# EasyEDA Pro project 交通信号灯第五版.epro

# Schematic 原理图
Create Date: 2024-08-05; Page Name: P1; Project Name: 交通信号灯转接板第五版; Schematic Name: 原理图; Update Date: 2024-08-15; Company: Chen; Page Size: A4; Version: V1.0
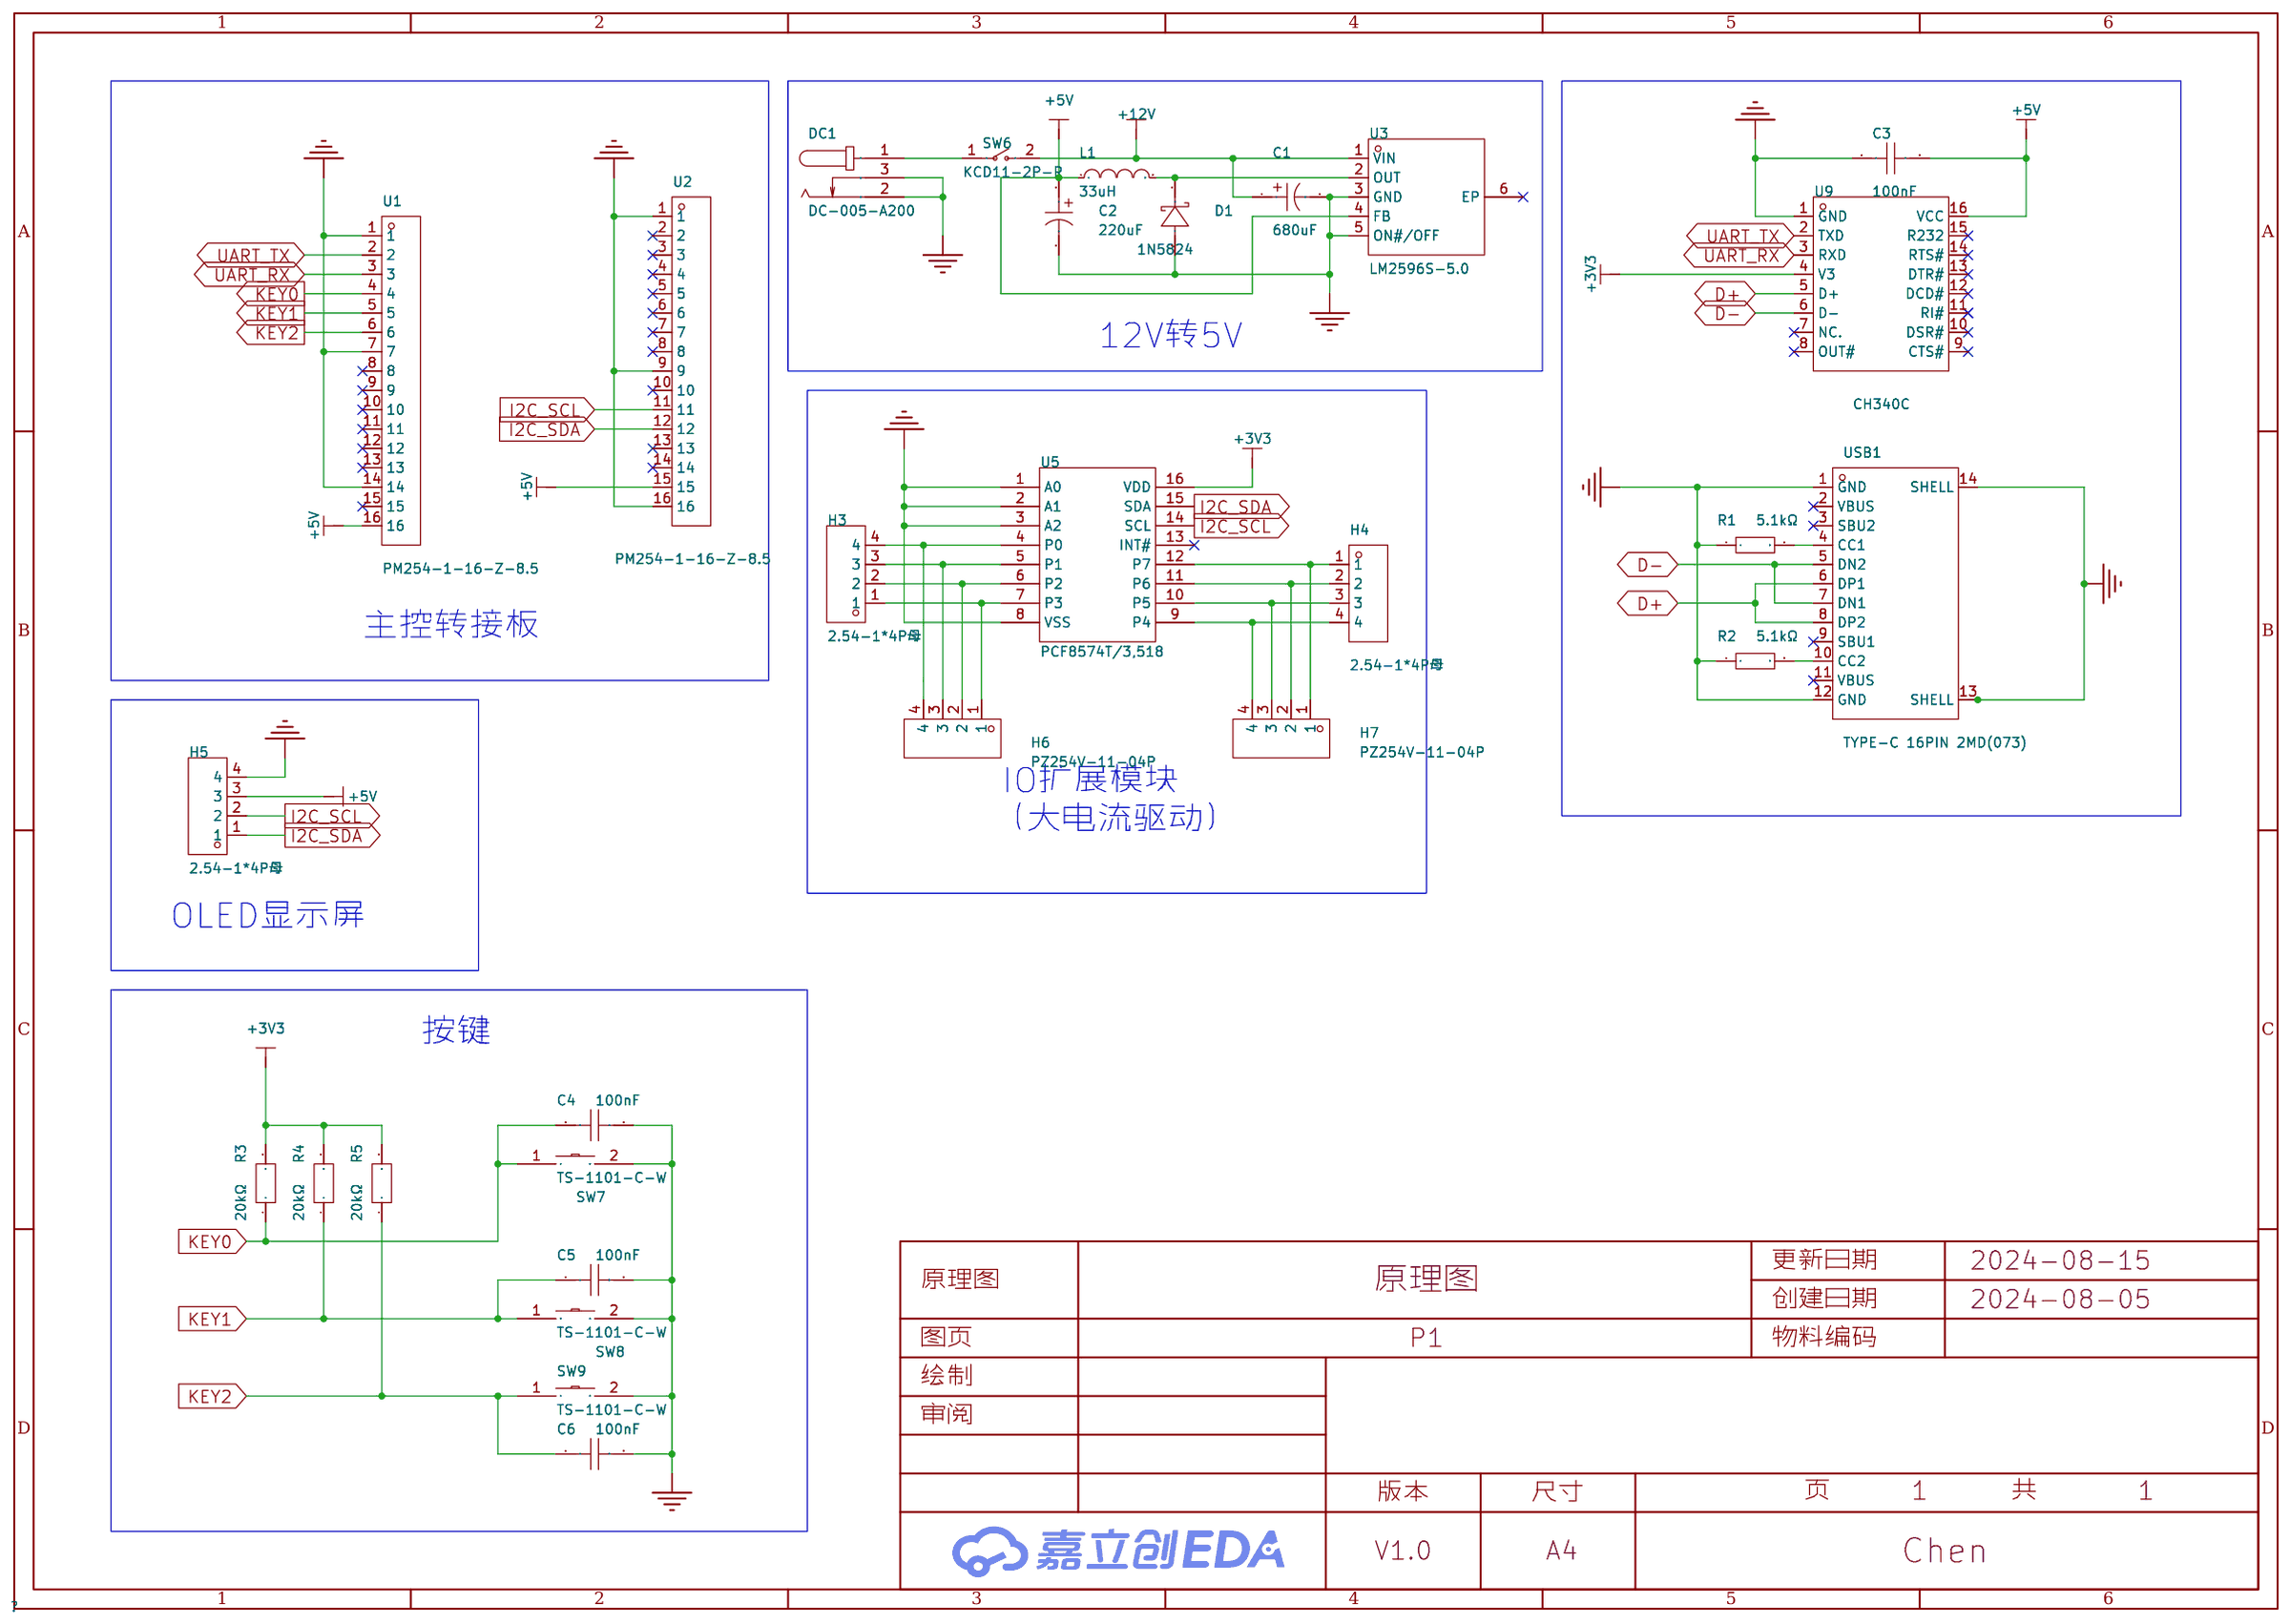
[diagram p0: schematic sheet]

## Parts
C1  680uF  [CAP-TH_BD8.0-P3.50-D0.6-FD]
C2  220uF  [CAP-SMD_BD6.3-L6.6-W6.6-LS7.4-FD]
C3  100nF  [CAP-TH_L7.2-W2.5-P5.00-D0.5]
C4  100nF  [CAP-TH_L7.2-W2.5-P5.00-D0.5]
C5  100nF  [CAP-TH_L7.2-W2.5-P5.00-D0.5]
C6  100nF  [CAP-TH_L7.2-W2.5-P5.00-D0.5]
D1  1N5824  [DO-27_BD5.3-L8.4-P12.40-D1.3-RD]
DC1  DC-005-A200  [DC-IN-TH_DC-005-A200]
H3  2.54-1*4P母  [HDR-TH_4P-P2.54-V-F]
H4  2.54-1*4P母  [HDR-TH_4P-P2.54-V-F]
H5  2.54-1*4P母  [HDR-TH_4P-P2.54-V-F]
H6  PZ254V-11-04P  [HDR-TH_4P-P2.54-V-M]
H7  PZ254V-11-04P  [HDR-TH_4P-P2.54-V-M]
L1  33uH  [IND-SMD_L7.0-W6.6_FXL0630]
R1  5.1kΩ  [R0603]
R2  5.1kΩ  [R0603]
R3  20kΩ  [R0603]
R4  20kΩ  [R0603]
R5  20kΩ  [R0603]
SW6  KCD11-2P-R  [SW-TH_2P-L15.0-W10.5-P5.00_KCD11-2P-R]
SW7  TS-1101-C-W  [SW-SMD_L6.0-W3.3-LS8.0]
SW8  TS-1101-C-W  [SW-SMD_L6.0-W3.3-LS8.0]
SW9  TS-1101-C-W  [SW-SMD_L6.0-W3.3-LS8.0]
U1  PM254-1-16-Z-8.5  [HDR-TH_16P-P2.54-V-F-A]
U2  PM254-1-16-Z-8.5  [HDR-TH_16P-P2.54-V-F-A]
U3  LM2596S-5.0  [TO-263-5_L10.2-W8.9-P1.70-BR]
U5  PCF8574T/3,518  [SOIC-16_L10.3-W7.5-P1.27-LS10.3-BL]
U9  CH340C  [SOP-16_L10.0-W3.9-P1.27-LS6.0-BL]
USB1  TYPE-C 16PIN 2MD(073)  [USB-C-SMD_TYPE-C-6PIN-2MD-073]

## Library data of the parts
C1 = SPT1AM681F12OR: 容值:680uF;精度:±20%;额定电压:10V;纹波电流:-;等效串联电阻:-;类型:-;; LCSC Part Name: 680uF ±20% 10V; Supplier Part: C698167; Manufacturer: Yunxing(云星); Supplier Footprint: 插件,D8xL12mm; JLCPCB Part Class: 扩展库; Datasheet: https://atta.szlcsc.com/upload/public/pdf/source/20200709/C697725_42901235359D2F905A7BBBDFFA1D5D23.pdf; Supplier: LCSC; Tolerance: ±20%; Rated Voltage: 10V; Lead Spacing: 3.5mm; φD: 8mm; L: 12mm; Lifetime @ Temp: 2000hrs@105℃; Operating Temperature: -55℃~+105℃
C2 = RVT1E221M0607: 容值:220uF;精度:±20%;额定电压:25V;纹波电流:150mA@120Hz;等效串联电阻:-;; LCSC Part Name: 220uF ±20% 25V; Supplier Part: C2918361; Manufacturer: ROQANG(容强); Supplier Footprint: SMD,D6.3xL7.7mm; JLCPCB Part Class: 扩展库; Datasheet: https://atta.szlcsc.com/upload/public/pdf/source/20211118/497C0614266278696CA52BDF245B991F.pdf; Supplier: LCSC; Tolerance: ±20%; Rated Voltage: 25V; Ripple Current: 150mA@120Hz; φD: 6.3mm; L: 7.7mm; Lifetime @ Temp: 2000hrs@105℃; Operating Temperature: -40℃~+105℃
C3-C6 = C242A104J2SC350: 容值:100nF;精度:±5%;额定电压:100V;介电材料:金属化聚酯膜电容;工作温度:-55℃~+125℃;; LCSC Part Name: 100nF ±5% 100V; Supplier Part: C401246; Manufacturer: faratronic(厦门法拉); Supplier Footprint: 插件,P=5mm; JLCPCB Part Class: 扩展库; Datasheet: https://atta.szlcsc.com/upload/public/pdf/source/20190717/C404864_C9CB3388AB32E0CC4E5DE29D1D44F6BC.pdf; Supplier: LCSC; Tolerance: ±5%; Voltage Rated: 100V; Dielectric Material: 金属化聚酯膜电容; Operating Temperature: -55℃~+125℃
D1 = 1N5824_C7503125: 二极管配置:独立式;正向压降(Vf):550mV@5A;直流反向耐压(Vr):30V;平均整流电流(Io):5A;; LCSC Part Name: 电压:30V 电流:5A; Supplier Part: C7503125; Manufacturer: FUXINSEMI(富芯森美); Supplier Footprint: DO-201AD; JLCPCB Part Class: 扩展库; Datasheet: https://atta.szlcsc.com/upload/public/pdf/source/20230904/20F3394C6D1B7A17743713246CA97DB3.pdf; Supplier: LCSC; Diode Configuration: 独立式; Forward Voltage (Vf@If): 550mV@5A; Reverse Voltage (Vr): 30V; Average Rectified Current (Io): 5A; Reverse Leakage Current (Ir): 500uA@30V; Peak forward surge current: 150A
DC1 = DC-005-A200: 连接器类型:DC电源插座;安装方式:弯插;触点内径:2mm;触点外径:6.4mm;额定电流:3A;额定电压:30V;工作温度范围:-20℃~+70℃;; LCSC Part Name: DC电源插座 内径:2mm 外径:6.4mm; Supplier Part: C720557; Manufacturer: XUNPU(讯普); Supplier Footprint: 插件; JLCPCB Part Class: 扩展库; Datasheet: https://atta.szlcsc.com/upload/public/pdf/source/20200812/C720557_2286DFCD6C75B71AF905731F627ABF3A.pdf; Supplier: LCSC; Connector Type: DC电源插座; Mounting Style: 弯插; Inside Contact Diameter: 2mm; Outside Contact Diameter: 6.4mm; Current Rating (Max): 3A; Voltage Rating (Max): 30V; Operating Temperature Range: -20℃~+70℃
H3-H5 = 2.54-1*4P母: 插孔结构:1x4P;间距:2.54mm;行距:-;圆孔/方孔:方孔;安装类型:直插;排数:单排;总孔位数:4P;额定电流:3A;额定电压:-;插孔方向:顶部;塑高:-;触头材质:青铜;触头镀层:-;工作温度范围:-40℃~+105℃;焊接温度(最大值):-;; LCSC Part Name: 间距:2.54mm 1x4P 直插; Supplier Part: C2718488; Manufacturer: BOOMELE(博穆精密); Supplier Footprint: 插件,P=2.54mm; JLCPCB Part Class: 扩展库; Datasheet: https://atta.szlcsc.com/upload/public/pdf/source/20210301/C2718488_F4427B881E42CAA8DDB0B1C12B3A522C.pdf; Supplier: LCSC; Holes Structure: 1x4P; Pitch: 2.54mm; Circular Hole / Square Hole: 方孔; Mounting Type: 直插; Number of Rows: 单排; Number of Holes: 4P; Current Rating (Max): 3A; Holes Direction: 顶部; Contact Material: 青铜; Operating Temperature Range: -40℃~+105℃
H6 H7 = PZ254V-11-04P: 插针结构:1x4P;间距:2.54mm;行距:-;圆针/方针:方针;安装类型:直插;排数:单排;总PIN位数:4P;额定电流:3A;额定电压:250V;配合针长度:6mm;塑高:2.5mm;端接针长度:3mm;触头材质:-;工作温度范围:-40℃~+105℃;颜色:黑色;; LCSC Part Name: 间距:2.54mm 1x4P 直插 方针; Supplier Part: C2691448; Manufacturer: XFCN(兴飞); Supplier Footprint: 插件,P=2.54mm; JLCPCB Part Class: 扩展库; Datasheet: https://atta.szlcsc.com/upload/public/pdf/source/20200309/C492403_F9F19131791D08044AD4F84F8E751A34.pdf; Supplier: LCSC; Pin Structure: 1x4P; Pitch: 2.54mm; Circluar Pins/Square Pins: 方针; Mounting Type: 直插; Number of Rows: 单排; Number of Pins: 4P; Current Rating (Max): 3A; Voltage Rating (Max): 250V; Length of Mating Pin: 6mm; Insulation Height: 2.5mm; Length of End Connection Pin: 3mm; Operating Temperature Range: -40℃~+105℃; Color: 黑色
L1 = FXL0630-330-M: 电感值:33uH;精度:±20%;额定电流:2A;饱和电流(Isat):2.5A;类型:一体成型电感;; LCSC Part Name: 33uH ±20% 2.5A; Supplier Part: C177245; Manufacturer: cjiang(长江微电); Supplier Footprint: SMD,6.6x7mm; JLCPCB Part Class: Extended Part; Datasheet: https://atta.szlcsc.com/upload/public/pdf/source/20240426/3189EA8206330E2108542F9E34E540E7.pdf; Supplier: LCSC; Tolerance: ±20%; Rated Current: 2A; Saturation Current (Isat): 2.5A; DC Resistance (DCR): 310mΩ; Type: 一体成型电感
R1 R2 = 0603WAF5101T5E: 电阻类型:厚膜电阻;阻值:5.1kΩ;精度:±1%;功率:100mW;最大工作电压:75V;温度系数:±100ppm/℃;; LCSC Part Name: 5.1kΩ ±1% 100mW 厚膜电阻; Supplier Part: C23186; Manufacturer: UNI-ROYAL(厚声); Supplier Footprint: 0603; JLCPCB Part Class: 基础库; Datasheet: https://atta.szlcsc.com/upload/public/pdf/source/20200306/C422600_1E6D84923E4A46A82E41ADD87F860B5C.pdf; Supplier: LCSC; Type: 厚膜电阻; Tolerance: ±1%; Power(Watts): 100mW; Overload Voltage (Max): 75V; Temperature Coefficient: ±100ppm/℃; Operating Temperature Range: -55℃~+155℃
R3-R5 = RT0603BRD0720KL: 电阻类型:薄膜电阻;阻值:20kΩ;精度:±0.1%;功率:100mW;最大工作电压:75V;温度系数:±25ppm/℃;; LCSC Part Name: 薄膜电阻 20kΩ ±0.1% 100mW; Supplier Part: C723637; Manufacturer: YAGEO(国巨); Supplier Footprint: 0603; JLCPCB Part Class: 扩展库; Datasheet: https://atta.szlcsc.com/upload/public/pdf/source/20200814/C723637_57E5E8B3C02F5D5BA42E401EB3E82C8B.pdf; Supplier: LCSC; Type: 薄膜电阻; Tolerance: ±0.1%; Power(Watts): 100mW; Overload Voltage (Max): 75V; Temperature Coefficient: ±25ppm/℃; Operating Temperature Range: -55℃~+155℃
SW6 = KCD11-2P-R: 带灯:无;引脚样式:焊片;额定电流:3A;额定电压(AC):250V;额定电压(DC):-;电路结构:单刀单掷;机械寿命:1万次;; LCSC Part Name: 10.5*15mm 两脚两档跷板开关 红钮; Supplier Part: C5884414; Manufacturer: SHOU HAN(首韩); Supplier Footprint: 插件; JLCPCB Part Class: 扩展库; Datasheet: https://atta.szlcsc.com/upload/public/pdf/source/20230506/CD06DFDE35C8048D34175BFF4AF6A2C2.pdf; Supplier: LCSC; Switch Length: 15mm; Switch Width: 10.5mm; Switch Height: 17.2mm; Actuator Type: 凹面弯曲; With Lamp: 无; Pin Style: 焊片; Actuator Color: 红色; Contact Current: 3A; Voltage Rating (AC): 250V; Circuit: 单刀单掷; Mechanical Life: 1万次; Operating Temperature: 0℃~+125℃; Actuator Identifier: - O
SW7-SW9 = TS-1101-C-W: 电路结构:单刀单掷;按钮形状:矩形按钮;作用力:260gf;安装方式:立贴;开关长度:6mm;开关宽度:3.6mm;开关高度:2.5mm;带支架:不带;触点电流:50mA;额定电压(AC):-;额定电压(DC):12V;额定功率:-;绝缘电阻:-;带灯:无;机械寿命:5万次;; LCSC Part Name: 6*3.6*2.5mm 立贴 轻触开关; Supplier Part: C318938; Manufacturer: XKB Connectivity(中国星坤); Supplier Footprint: SMD; JLCPCB Part Class: 扩展库; Datasheet: https://atta.szlcsc.com/upload/public/pdf/source/20200227/C318938_C2E53B1EEDE37D980A33616AC086DE53.pdf; Supplier: LCSC; Circuit: 单刀单掷; Actuator Style: 矩形按钮; Operating Force: 260gf; Mounting Style: 立贴; Switch Length: 6mm; Switch Width: 3.6mm; Switch Height: 2.5mm; Strike Gundam: 不带; Contact Current: 50mA; Voltage Rating (DC): 12V; Actuator/Cap Color: 白色带淡绿; With Lamp: 无; Mechanical Life: 5万次; Operating Temperature: -30℃~+85℃
U1 U2 = PM254-1-16-Z-8.5: 插孔结构:1x16P;间距:2.54mm;行距:-;圆孔/方孔:方孔;安装类型:直插;排数:单排;总孔位数:16P;额定电流:3A;额定电压:-;插孔方向:顶部;塑高:8.5mm;触头材质:铜合金;工作温度范围:-40℃~+105℃;焊接温度(最大值):260℃@5S;; LCSC Part Name: 1x16P 间距:2.54mm 直插; Supplier Part: C2897379; Manufacturer: HCTL(华灿天禄); Supplier Footprint: 插件,P=2.54mm; JLCPCB Part Class: 扩展库; Datasheet: https://atta.szlcsc.com/upload/public/pdf/source/20230609/534BE42964C679BDE98E061007C4ABD6.pdf; Supplier: LCSC; Holes Structure: 1x16P; Pitch: 2.54mm; Circular Hole / Square Hole: 方孔; Mounting Type: 直插; Number of Rows: 单排; Number of Holes: 16P; Current Rating (Max): 3A; Holes Direction: 顶部; Insulation Height: 8.5mm; Contact Material: 铜合金; Operating Temperature Range: -40℃~+105℃; Soldering Temperature(Max): 260℃@5S
U3 = LM2596S-5.0_C347421: 功能类型:降压型;输出类型:固定;输入电压:40V;输出电压:5V;输出电流(最大值):3A;; Supplier Part: C347421; Manufacturer: UMW(友台半导体); Supplier Footprint: TO-263-5; JLCPCB Part Class: 扩展库; Datasheet: https://atta.szlcsc.com/upload/public/pdf/source/20230506/0930E65C3A8B7B120C8A4D8E5A8AC327.pdf; Supplier: LCSC; Function: 降压型; Output Type: 固定; Input Voltage: 40V; Output Voltage: 5V; Output Current (Max): 3A; Switching Frequency: 150kHz; Operating Temperature: -40℃~+125℃@(TA); Synchronous Rectification: 否; Number of Outputs: 1; Topology: 降压式; Switch tube (built-in/external): 内置
U5 = PCF8574T/3,518: 接口:I2C;I/O数量:8;时钟频率:100kHz;; LCSC Part Name: I2C总线 远程8位I/O扩展; Supplier Part: C7605; Manufacturer: NXP(恩智浦); Supplier Footprint: SOIC-16-300mil; JLCPCB Part Class: 扩展库; Datasheet: https://atta.szlcsc.com/upload/public/pdf/source/20120505/1457706490055.pdf; Supplier: LCSC; Interface: I2C; Number of I/O: 8; Interrupt Output: 有中断输出; Output Type: 推挽式; Supply Voltage: 2.5V~6V; Output Source current: 300uA; Output Sink Current: 25mA; Clock Frequency: 100kHz; Operating Temperature: -40℃~+85℃
U9 = CH340C: 应用功能:收发器;接口协议:USB 2.0;数据速率:2Mbps;; LCSC Part Name: CH340C USB转串口芯片 CH340; Supplier Part: C84681; Manufacturer: WCH(南京沁恒); Supplier Footprint: SOP-16; JLCPCB Part Class: 扩展库; Datasheet: https://atta.szlcsc.com/upload/public/pdf/source/20200819/C84681_ADBED554CE321879DBD6B1D06488689C.pdf; Supplier: LCSC; Applications Function: 收发器; Protocol: USB 2.0; Supply Voltage: 3.3V；5V; Data Rate: 2Mbps
USB1 = TYPE-C 16PIN 2MD(073): 连接器类型:Type-C;标准:-;公母:母;端口数量:1;触点数量:16P;安装方式:卧贴;额定电流 - 电源:5A;工作温度范围:-25℃~+85℃;; LCSC Part Name: Type-C 母 卧贴; Supplier Part: C2765186; Manufacturer: SHOU HAN(首韩); Supplier Footprint: SMD; JLCPCB Part Class: 扩展库; Datasheet: https://atta.szlcsc.com/upload/public/pdf/source/20211123/39B17C16241EAC15C5E277BDA434118E.pdf; Supplier: LCSC; Connector Type: Type-C; Gender: 母; Number of Ports: 1; Number of Contacts: 16P; Mounting Style: 卧贴; Current Rating - Power (Max): 5A; Operating Temperature Range: -25℃~+85℃

## Nets
+3V3: R3.2 R4.2 R5.2 U5.16(VDD) U9.4(V3)
+5V: C2.1 C3.2 H5.3 L1.1 U1.16 U2.15 U3.4(FB) U9.16(VCC)
+12V: C1.1 SW6.2 U3.1(VIN)
GND: C1.2 C2.2 C3.1 C4.2 C5.2 C6.2 D1.2(A) DC1.2 DC1.3 H5.4 R1.1 R2.1 SW7.2 SW8.2 SW9.2 U1.1 U1.7 U1.14 U2.1 U2.9 U2.16 U3.3(GND) U3.5(ON#/OFF) U5.1(A0) U5.2(A1) U5.3(A2) U5.8(VSS) U9.1(GND) USB1.1(GND) USB1.12(GND) USB1.13(SHELL) USB1.14(SHELL)
D+: U9.5(D+) USB1.6(DP1) USB1.8(DP2)
D-: U9.6(D-) USB1.5(DN2) USB1.7(DN1)
I2C_SCL: H5.2 U2.11 U5.14(SCL)
I2C_SDA: H5.1 U2.12 U5.15(SDA)
KEY0: C4.1 R3.1 SW7.1 U1.4
KEY1: C5.1 R4.1 SW8.1 U1.5
KEY2: C6.1 R5.1 SW9.1 U1.6
UART_RX: U1.3 U9.3(RXD)
UART_TX: U1.2 U9.2(TXD)
$1N3164: DC1.1 SW6.1
$1N3824: D1.1(K) L1.2 U3.2(OUT)
$1N13209: R2.2 USB1.10(CC2)
$1N13212: R1.2 USB1.4(CC1)
$1N13419: H3.3 H6.3 U5.5(P1)
$1N13432: H3.2 H6.2 U5.6(P2)
$1N13451: H3.1 H6.1 U5.7(P3)
$1N13458: H3.4 H6.4 U5.4(P0)
$1N13467: H4.4 H7.4 U5.9(P4)
$1N13474: H4.3 H7.3 U5.10(P5)
$1N13481: H4.2 H7.2 U5.11(P6)
$1N13488: H4.1 H7.1 U5.12(P7)

Not connected (* = marked no-connect by the designer): U1 8* 9* 10* 11* 12* 13* 15*; U2 2* 3* 4* 5* 6* 7* 8* 10* 13* 14*; U3 6(EP)*; U5 13(INT#)*; U9 7(NC.)* 8(OUT#)* 9(CTS#)* 10(DSR#)* 11(RI#)* 12(DCD#)* 13(DTR#)* 14(RTS#)* 15(R232)*; USB1 2(VBUS)* 3(SBU2)* 9(SBU1)* 11(VBUS)*

## Notes on the sheet
- 12V转5V
- 主控转接板
- IO扩展模块
  （大电流驱动）
- OLED显示屏
- 按键

# Board PCB
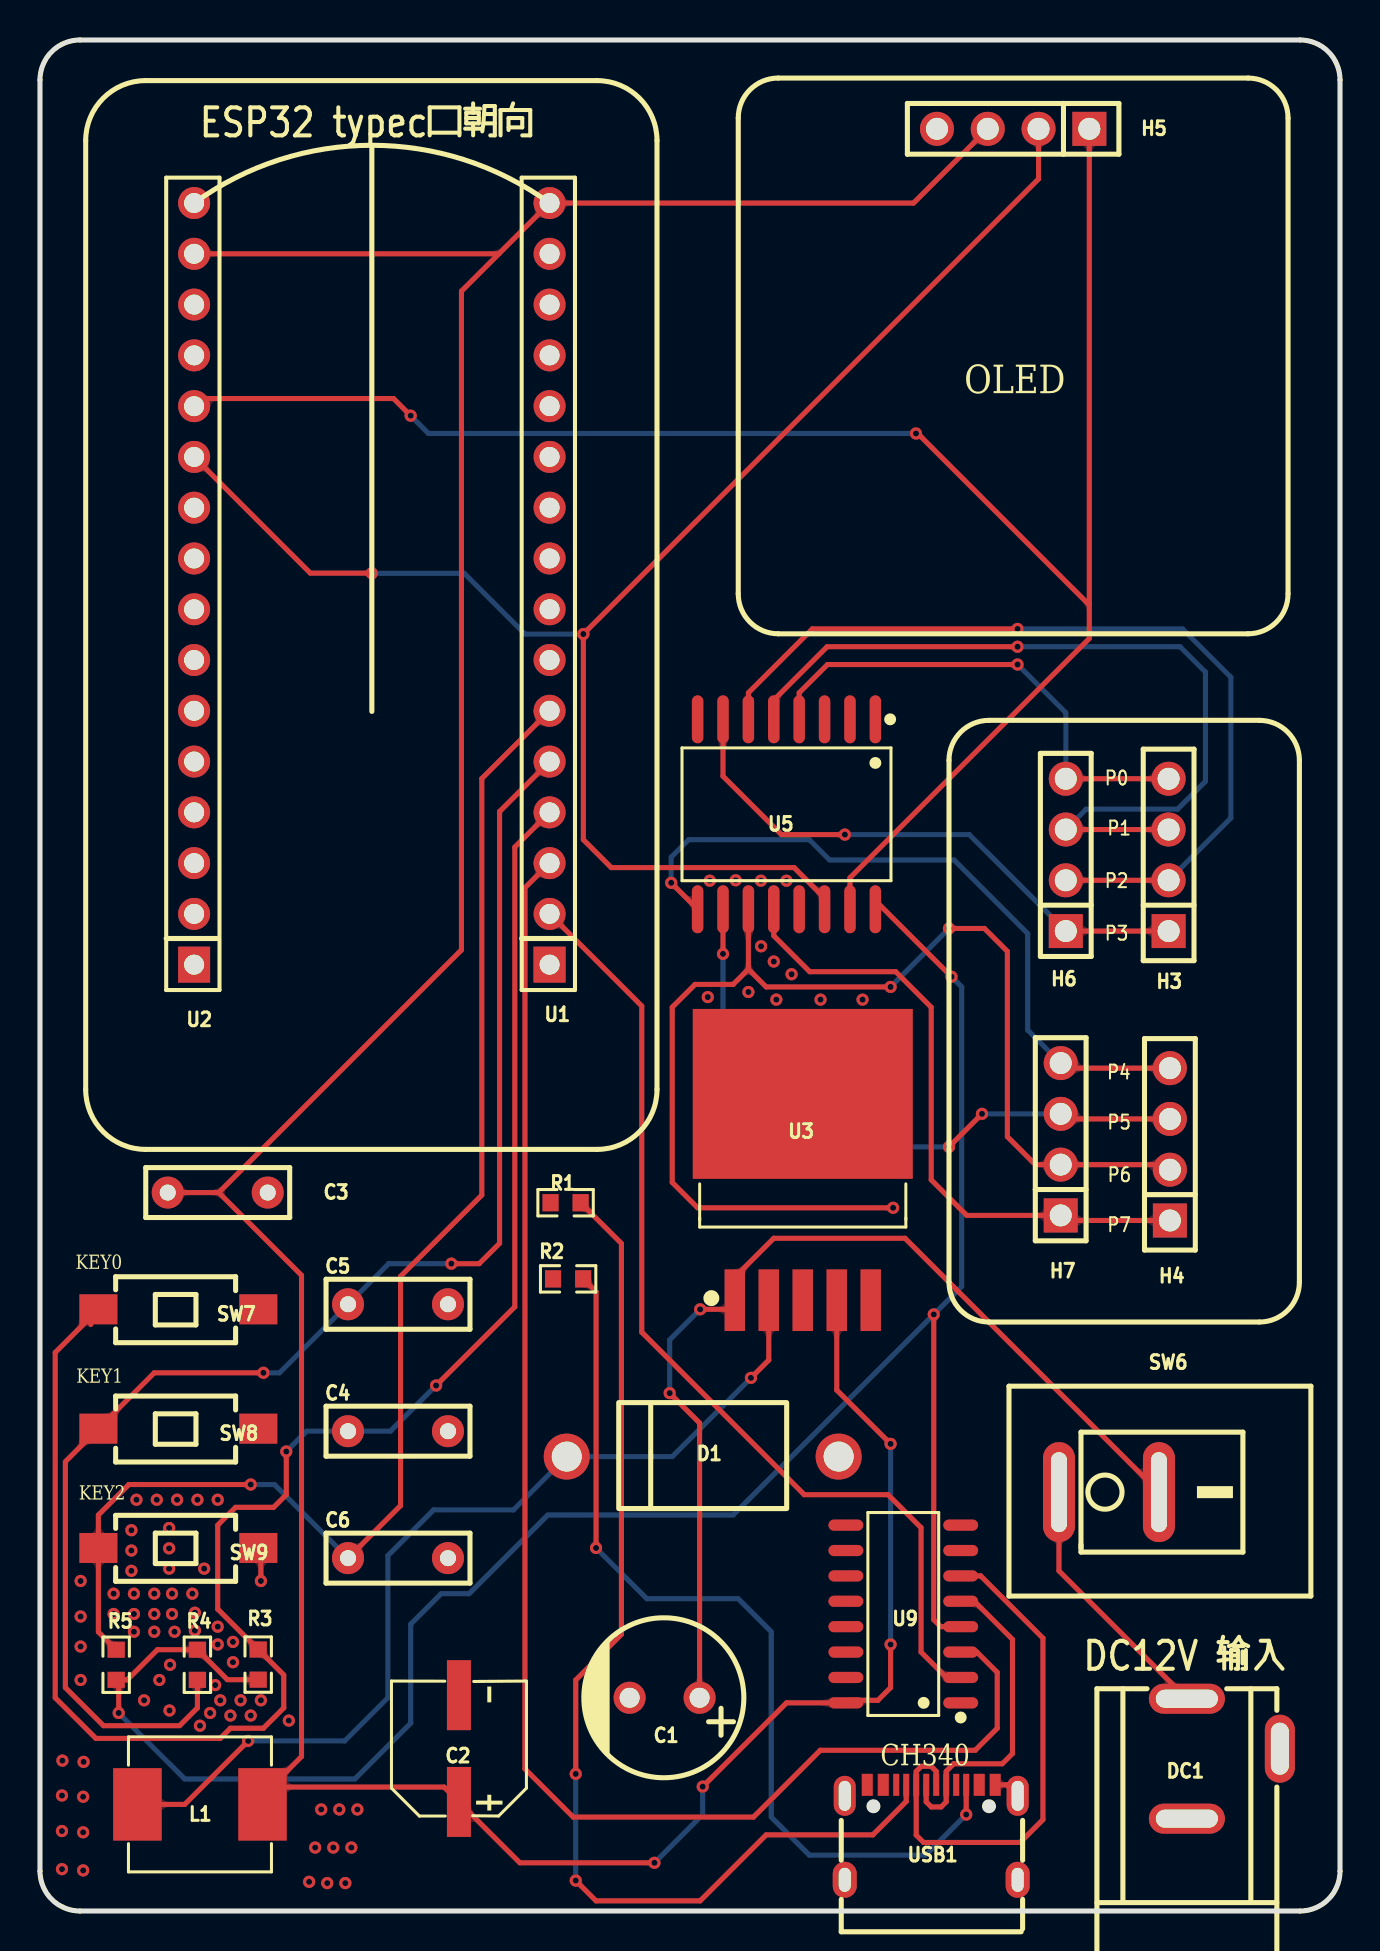
[diagram p1: board, top side]
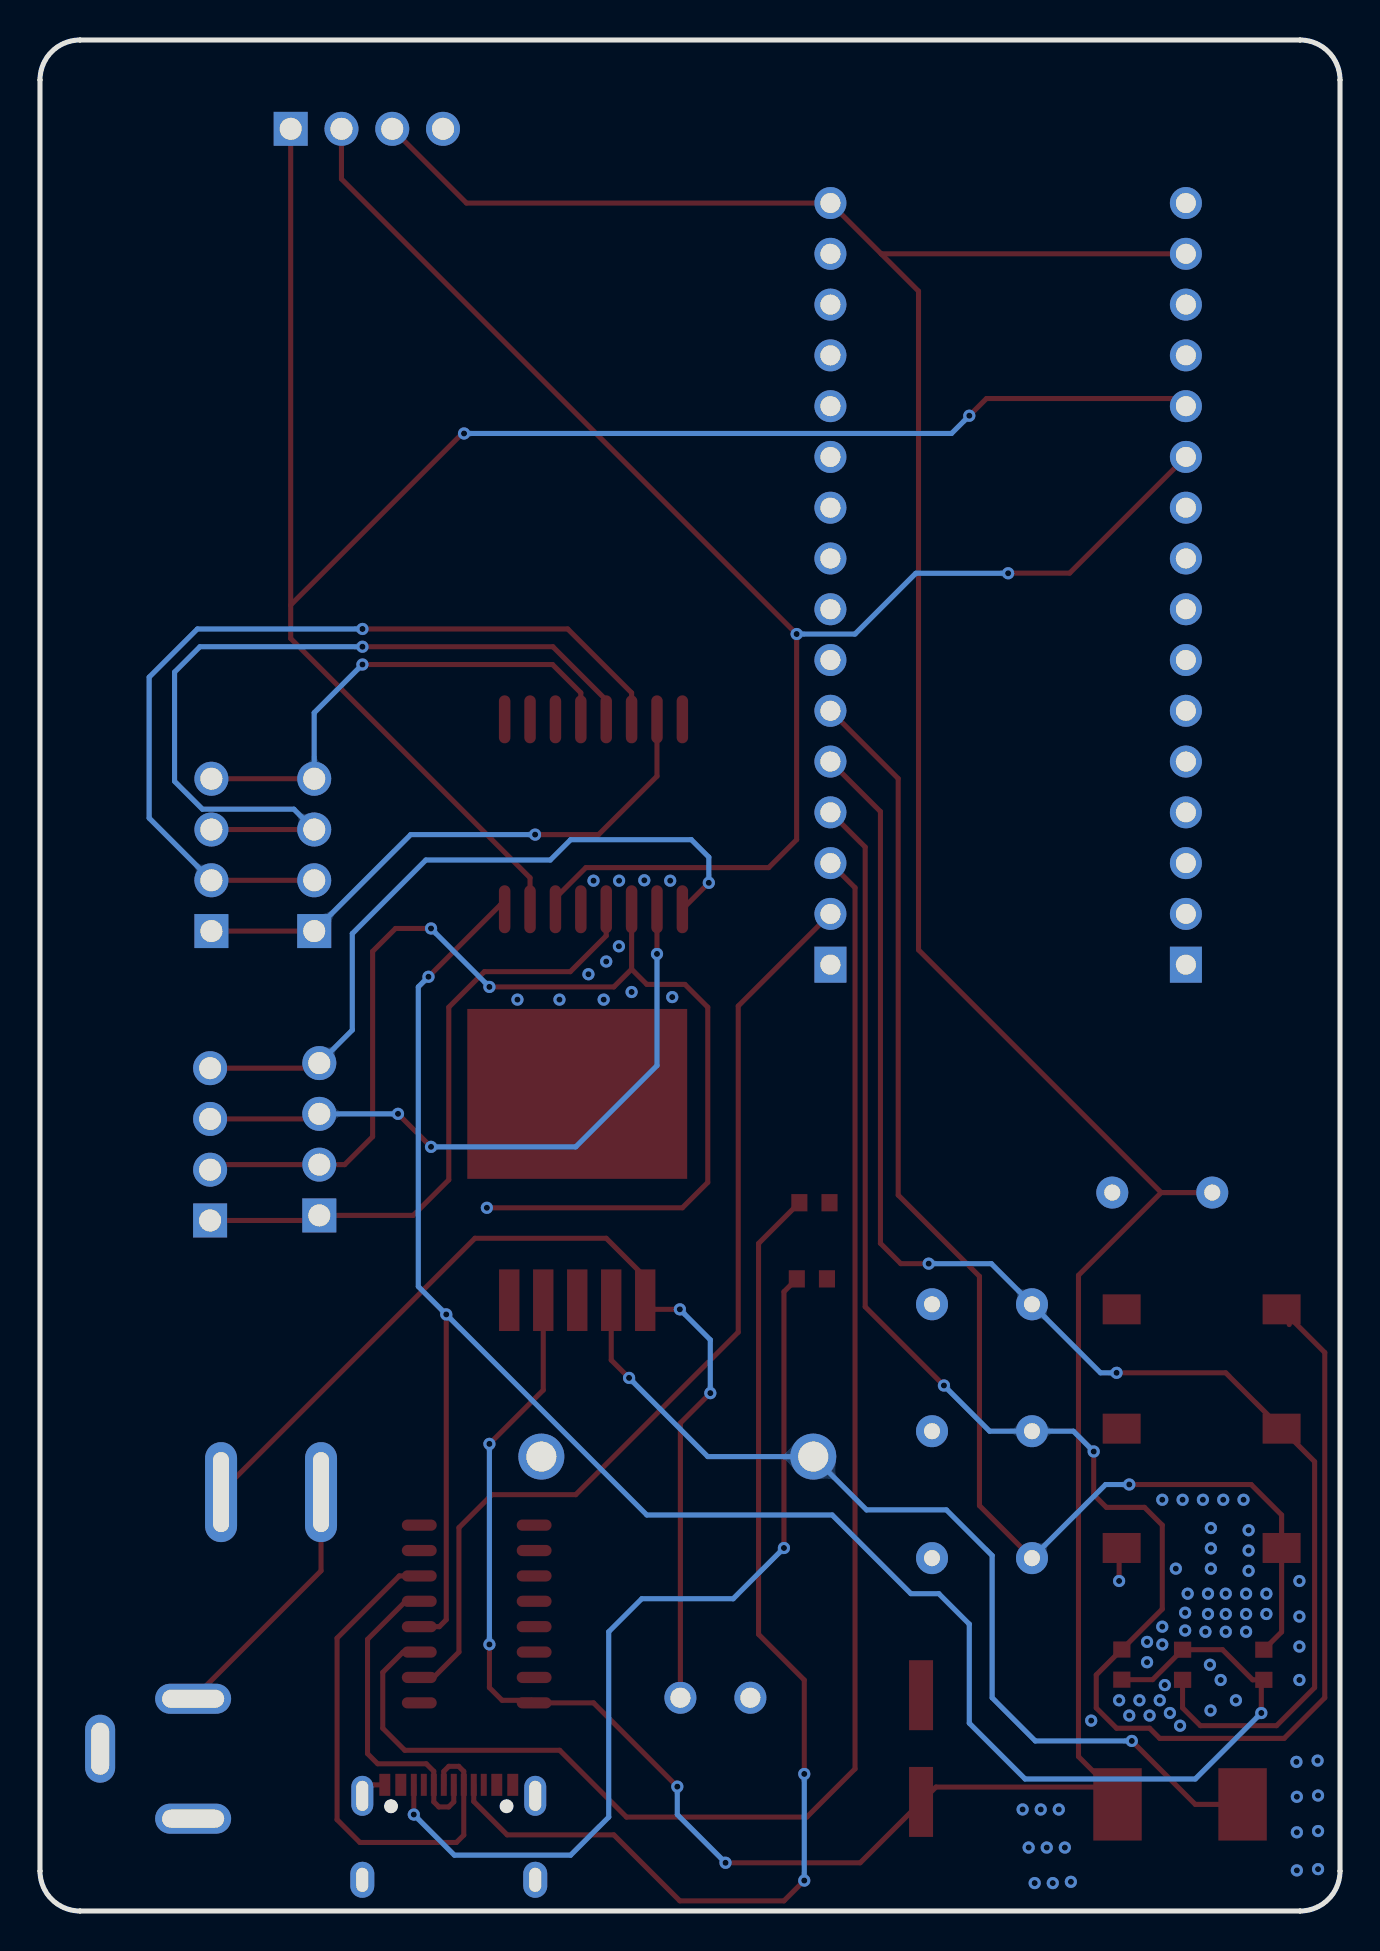
[diagram p2: board, bottom side, seen from below]

Outline 65.02 x 93.6 mm; copper layers: Top Layer, Bottom Layer. Coordinates in mm from the lower left corner of the outline.
Outline path: 0,91.6 0,2 arc(0.59,0.59) 2,0 63.02,0 arc(64.44,0.59) 65.02,2 65.02,91.6 arc(64.44,93.01) 63.02,93.6 2,93.6 arc(0.59,93.01) 0,91.6
Stack: Top Layer 0.035mm / Dielectric1 1.51mm FR4 er 4.5 / Bottom Layer 0.035mm

## Design rules (mm)
template: JLCPCB Capability(Two Layers Board)
spacing copperThickness1oz (default): track to track 0.102, other pairs 0.152 to 0.3
spacing copperThickness2oz: track to track 0.203, other pairs 0.152 to 0.3
track width copperThickness1oz (default): min 0.127, default 0.254, max 2.54
track width copperThickness2oz: min 0.203, default 0.254, max 2.54
differential pair differentialPair (default): width min 0.127, default 0.254, max 2.54; gap min 0.152, default 0.152
via viaSize (default): diameter min 0.5, default 0.61, max 10; hole min 0.3, default 0.305, max 6.3

## Placement (name value [footprint] x y rotation side)
C1  680uF  [CAP-TH_BD8.0-P3.50-D0.6-FD]  31.24 10.67 180 top
C2  220uF  [CAP-SMD_BD6.3-L6.6-W6.6-LS7.4-FD]  20.96 8.13 90 top
C3  100nF  [CAP-TH_L7.2-W2.5-P5.00-D0.5]  8.89 35.94 180 top
C4  100nF  [CAP-TH_L7.2-W2.5-P5.00-D0.5]  17.91 24 0 top
C5  100nF  [CAP-TH_L7.2-W2.5-P5.00-D0.5]  17.91 30.35 0 top
C6  100nF  [CAP-TH_L7.2-W2.5-P5.00-D0.5]  17.91 17.65 0 top
D1  1N5824  [DO-27_BD5.3-L8.4-P12.40-D1.3-RD]  33.15 22.73 0 top
DC1  DC-005-A200  [DC-IN-TH_DC-005-A200]  59.69 7.62 90 top
H3  2.54-1*4P母  [HDR-TH_4P-P2.54-V-F]  56.45 52.83 90 top
H4  2.54-1*4P母  [HDR-TH_4P-P2.54-V-F]  56.52 38.35 90 top
H5  2.54-1*4P母  [HDR-TH_4P-P2.54-V-F]  48.68 89.15 180 top
H6  PZ254V-11-04P  [HDR-TH_4P-P2.54-V-M]  51.31 52.83 90 top
H7  PZ254V-11-04P  [HDR-TH_4P-P2.54-V-M]  51.05 38.61 90 top
L1  33uH  [IND-SMD_L7.0-W6.6_FXL0630]  8 5.33 0 top
R1  5.1kΩ  [R0603]  26.29 35.43 0 top
R2  5.1kΩ  [R0603]  26.42 31.62 0 top
R3  20kΩ  [R0603]  10.91 12.33 270 top
R4  20kΩ  [R0603]  7.87 12.32 90 top
R5  20kΩ  [R0603]  3.81 12.32 270 top
SW6  KCD11-2P-R  [SW-TH_2P-L15.0-W10.5-P5.00_KCD11-2P-R]  53.47 20.95 0 top
SW7  TS-1101-C-W  [SW-SMD_L6.0-W3.3-LS8.0]  6.92 30.1 0 top
SW8  TS-1101-C-W  [SW-SMD_L6.0-W3.3-LS8.0]  6.92 24.13 0 top
SW9  TS-1101-C-W  [SW-SMD_L6.0-W3.3-LS8.0]  6.92 18.16 0 top
U1  PM254-1-16-Z-8.5  [HDR-TH_16P-P2.54-V-F-A]  25.49 66.39 90 top
U2  PM254-1-16-Z-8.5  [HDR-TH_16P-P2.54-V-F-A]  7.71 66.39 90 top
U3  LM2596S-5.0  [TO-263-5_L10.2-W8.9-P1.70-BR]  38.15 35.72 270 top
U5  PCF8574T/3,518  [SOIC-16_L10.3-W7.5-P1.27-LS10.3-BL]  37.34 54.86 180 top
U9  CH340C  [SOP-16_L10.0-W3.9-P1.27-LS6.0-BL]  43.18 14.86 90 top
USB1  TYPE-C 16PIN 2MD(073)  [USB-C-SMD_TYPE-C-6PIN-2MD-073]  44.58 3.94 0 top

## Footprints (pads in the part's own frame, mm; a bottom-side part is the same pattern mirrored in y, then rotated)
CAP-SMD_BD6.3-L6.6-W6.6-LS7.4-FD
  rect 3.5x1.2 smd: 1(-2.67,0) 2(2.67,0)
CAP-TH_BD8.0-P3.50-D0.6-FD
  round 1.6 hole 1: 1(-1.75,0) 2(1.75,0)
CAP-TH_L7.2-W2.5-P5.00-D0.5
  round 1.6 hole 0.8: 1(-2.5,0) 2(2.5,0)
DC-IN-TH_DC-005-A200
  oval 1.5x3.8 hole 0.9x3.1: 1(2.999,2.325) 2(-3,2.325)
  oval 3.4x1.5 hole 2.6x0.9: 3(0.5,-2.325)
DO-27_BD5.3-L8.4-P12.40-D1.3-RD
  round 2.3 hole 1.5: 1(-6.8,0) 2(6.8,0)
HDR-TH_4P-P2.54-V-F
  rect 1.7x1.7 hole 1.1: 1(-3.81,0)
  round 1.7 hole 1.1: 2(-1.27,0) 3(1.27,0) 4(3.81,0)
HDR-TH_4P-P2.54-V-M
  rect 1.7x1.7 hole 1.1: 1(-3.81,0)
  round 1.7 hole 1.1: 2(-1.27,0) 3(1.27,0) 4(3.81,0)
HDR-TH_16P-P2.54-V-F-A
  rect 1.8x1.6 hole 1: 1(-19.05,0)
  round 1.6 hole 1: 2(-16.51,0) 3(-13.97,0) 4(-11.43,0) 5(-8.89,0) 6(-6.35,0) 7(-3.81,0) 8(-1.27,0) 9(1.27,0) 10(3.81,0) 11(6.35,0) 12(8.89,0) 13(11.43,0) 14(13.97,0) 15(16.51,0) 16(19.05,0)
IND-SMD_L7.0-W6.6_FXL0630
  rect 2.424x3.62 smd: 1(3.128,0) 2(-3.128,0)
R0603
  rect 0.806x0.864 smd: 1(-0.753,0) 2(0.753,0)
SOIC-16_L10.3-W7.5-P1.27-LS10.3-BL
  oval 0.574x2.401 smd: 1(-4.445,-4.75) 2(-3.175,-4.75) 3(-1.905,-4.75) 4(-0.635,-4.75) 5(0.635,-4.75) 6(1.905,-4.75) 7(3.175,-4.75) 8(4.445,-4.75) 9(4.445,4.75) 10(3.175,4.75) 11(1.905,4.75) 12(0.635,4.75) 13(-0.635,4.75) 14(-1.905,4.75) 15(-3.175,4.75) 16(-4.445,4.75)
SOP-16_L10.0-W3.9-P1.27-LS6.0-BL
  oval 0.56x1.745 smd: 1(-4.445,-2.873) 2(-3.175,-2.873) 3(-1.905,-2.873) 4(-0.635,-2.873) 5(0.635,-2.873) 6(1.905,-2.873) 7(3.175,-2.873) 8(4.445,-2.873) 9(4.445,2.873) 10(3.175,2.873) 11(1.905,2.873) 12(0.635,2.873) 13(-0.635,2.873) 14(-1.905,2.873) 15(-3.175,2.873) 16(-4.445,2.873)
SW-SMD_L6.0-W3.3-LS8.0
  rect 1.9x1.5 smd: 1(-4,0) 2(4,0)
SW-TH_2P-L15.0-W10.5-P5.00_KCD11-2P-R
  oval 1.6x5 hole 0.8x4: 1(-2.5,0) 2(2.5,0)
TO-263-5_L10.2-W8.9-P1.70-BR
  rect 3.083x1.02 smd: 1(5.16,-3.4) 2(5.16,-1.7) 3(5.16,0) 4(5.16,1.7) 5(5.16,3.4)
  rect 8.5x11 smd: 6(-5.16,0)
USB-C-SMD_TYPE-C-6PIN-2MD-073
  rect 0.55x1.1 smd: 1(-3.2,2.375) 2(-2.4,2.375) 11(2.4,2.375) 12(3.2,2.375)
  rect 0.3x1.1 smd: 3(-1.75,2.375) 4(-1.25,2.375) 5(-0.75,2.375) 6(-0.25,2.375) 7(0.25,2.375) 8(0.75,2.375) 9(1.25,2.375) 10(1.75,2.375)
  oval 1.1x2 hole 0.6x1.5: 13(-4.325,1.825) 14(4.325,1.825)
  oval 1.2x1.8 hole 0.6x1.2: 13(-4.325,-2.375) 14(4.325,-2.375)

## Nets
As in the schematic.

Pads without a net: U1 8 9 10 11 12 13 15; U2 2 3 4 5 6 7 8 10 13 14; U3 6; U5 13; U9 7 8 9 10 11 12 13 14 15; USB1 2 3 9 11

## Via types
v1: diameter 0.61, hole 0.305, Top Layer to Bottom Layer, 112 vias

## Routing (per net, layer and track width the routed paths; a pad name or vN(x,y) marks a point on that pad's centre or on a via; arc(x,y) is an arc through that point)
+3V3: length 104.6
  Top Layer w0.254: U9.4 45.05,14.22 44.7,14.57 v1(44.7,29.84) ; v1(45.59,46.74) 42,50.33 U5.16 ; v1(3.94,9.91) 3.94,11.44 R5.2 4.37,11.57 5.88,13.07 R4.2 9.37,11.57 R3.2
  Bottom Layer w0.254: v1(45.59,46.74) 46.1,46.23 46.1,31.24 v1(44.7,29.84) 34.67,19.81 25.4,19.81 21.46,15.88 20.07,15.88 18.54,14.35 18.54,9.4 15.75,6.6 7.24,6.6 v1(3.94,9.91)
+5V: length 188.2
  Top Layer w0.254: v1(42.55,13.33) 42.55,11.18 41.91,10.54 40.43,10.54 U9.16 37.34,10.41 v1(33.15,6.22) ; 22.95,82.9 U1.16 43.69,85.44 H5.3 ; 22.95,82.9 U2.15 ; 22.95,82.9 21.08,81.03 21.08,48.08 8.94,35.94 ; v1(42.55,23.37) 39.85,26.06 U3.4 ; L1.1 11.56,5.76 11.56,6.2 ; C3.2 8.94,35.94 ; 8.94,35.94 13.08,31.8 13.08,7.73 11.56,6.2 ; 11.56,6.2 20.21,6.2 C2.1 24,2.41 v1(30.73,2.41)
  Bottom Layer w0.254: v1(33.15,6.22) 33.15,4.83 v1(30.73,2.41) ; v1(42.55,23.37) v1(42.55,13.33)
+12V: length 50.7
  Top Layer w0.254: SW6.2 43.27,33.65 36.7,33.65 34.75,31.7 U3.1 34.29,30.1 v1(33.02,30.1) ; 31.62,25.78 32.99,24.41 C1.1
  Bottom Layer w0.254: 32.89,29.97 31.5,28.57 v1(31.5,25.91)
GND: length 3.1
  Top Layer w0.254: SW9.2 11.05,18.03 v1(11.05,16.51) ; 48.9,5.76 48.35,6.31 USB1.12
  vias: v1(1.12,7.52) v1(1.1,5.78) v1(1.1,4) v1(1.1,2.1) v1(2.03,16.51) v1(2.03,14.73) v1(2.03,13.23) v1(2.03,11.56) v1(2.18,7.46) v1(2.16,5.71) v1(2.16,3.94) v1(2.16,2.03) v1(3.68,15.88) v1(3.68,14.86) v1(4.57,19.05) v1(4.57,18.03) v1(4.57,17.02) v1(4.7,15.88) v1(4.7,14.86) v1(4.7,13.97) v1(4.83,20.57) v1(5.21,10.54) v1(5.72,15.88) v1(5.72,14.86) v1(5.72,13.97) v1(5.84,20.57) v1(5.97,11.56) v1(6.46,19.16) v1(6.46,18.14) v1(6.46,17.13) v1(6.48,10.03) v1(6.51,12.32) v1(6.6,15.88) v1(6.6,14.86) v1(6.73,13.97) v1(6.86,20.57) v1(7.62,15.88) v1(7.75,14.92) v1(7.75,14.03) v1(7.87,20.57) v1(8,9.27) v1(8.21,17.13) v1(8.51,9.91) v1(8.76,11.3) v1(8.89,20.57) v1(8.89,14.22) v1(8.89,13.33) v1(9.02,10.54) v1(9.53,9.78) v1(9.65,13.46) v1(9.65,12.45) v1(10.03,10.54) v1(10.54,9.78) v1(11.05,10.54) v1(12.45,9.52) v1(13.46,1.46) v1(13.76,3.17) v1(14.07,5.08) v1(14.37,1.4) v1(14.67,3.17) v1(14.97,5.08) v1(15.27,1.4) v1(15.57,3.17) v1(15.88,5.08) v1(33.4,45.72) v1(33.5,51.54) v1(34.8,51.56) v1(35.43,45.97) v1(36.06,51.54) v1(36.07,48.26) v1(36.7,47.5) v1(36.83,45.59) v1(37.34,51.54) v1(37.59,46.86) v1(39.04,45.59) v1(41.14,45.59)
D+: length 16.4
  Top Layer w0.254: 46.05,15.49 46.74,15.49 48.64,13.59 48.64,7.87 48.13,7.37 45.7,7.37 45.33,6.99 USB1.8 45.33,5.46 45.07,5.21 44.58,5.21 44.33,5.46 USB1.6
D-: length 26.5
  Top Layer w0.254: USB1.7 44.83,6.98 44.57,7.24 44.08,7.24 43.83,6.98 USB1.5 43.83,3.8 44.2,3.43 49.02,3.43 50.16,4.57 50.16,13.65 47.05,16.76 U9.6
I2C_SCL: length 81.9
  Top Layer w0.254: U5.14 39.24,50.67 37.72,52.2 28.58,52.2 27.18,53.59 v1(27.18,63.88) 49.94,86.65 H5.2 ; U2.11 13.52,66.93 16.51,66.93
  Bottom Layer w0.254: v1(27.18,63.88) 24.26,63.88 21.22,66.92 v1(16.6,66.92)
I2C_SDA: length 93.2
  Top Layer w0.254: 52.49,65.33 43.9,73.91 v1(43.81,73.91) ; 52.49,65.33 H5.1 ; 52.49,65.33 52.49,63.66 40.51,51.69 U5.15 ; v1(18.54,74.8) 17.68,75.66 8.09,75.66 U2.12
  Bottom Layer w0.254: v1(18.54,74.8) 19.43,73.91 v1(43.81,73.91)
KEY0: length 90.1
  Top Layer w0.254: 2.54,29.34 2.54,29.72 ; 2.54,29.72 0.76,27.94 0.76,10.67 2.79,8.64 9.02,8.64 9.53,9.14 11.18,9.14 12.19,10.16 12.19,11.81 10.92,13.08 R3.1 8.89,15.1 8.89,19.3 9.78,20.19 11.68,20.19 12.32,20.83 12.32,22.86 ; 2.54,29.72 SW7.1 ; U1.4 23.75,53.22 23.75,30.23 v1(19.81,26.29)
  Bottom Layer w0.254: v1(12.32,22.99) 13.34,24 C4.1 17.53,24 v1(19.81,26.29)
KEY1: length 71.8
  Top Layer w0.254: v1(20.57,32.38) 21.97,32.38 22.99,33.4 22.99,55 U1.5 ; R4.1 7.87,10.16 6.98,9.27 3.18,9.27 1.27,11.18 1.27,22.48 SW8.1 5.72,26.92 v1(11.18,26.92)
  Bottom Layer w0.254: v1(11.18,26.92) 11.98,26.92 C5.1 17.44,32.38 v1(20.57,32.38)
KEY2: length 68.3
  Top Layer w0.254: R5.1 2.92,13.96 SW9.1 2.92,19.81 4.45,21.34 v1(10.54,21.34) ; C6.1 18.03,20.28 18.03,31.75 22.1,35.81 22.1,56.65 U1.6
  Bottom Layer w0.254: C6.1 11.72,21.34 v1(10.54,21.34)
UART_RX: length 77.3
  Top Layer w0.254: U1.3 24.26,51.19 24.26,7.11 26.67,4.7 35.69,4.7 39.03,8.04 46.78,8.04 47.88,9.14 47.88,11.94 46.86,12.95 U9.3
UART_TX: length 49.6
  Top Layer w0.254: U9.2 45.34,11.68 44.07,12.95 44.07,19.18 42.42,20.83 38.23,20.83 30.1,28.96 30.1,45.27 U1.2
$1N3164: length 13
  Top Layer w0.254: SW6.1 50.97,17.02 DC1.1
$1N3824: length 47.9
  Top Layer w0.254: v1(10.41,8.51) 7.24,5.33 L1.2 ; U3.2 36.45,27.56 v1(35.56,26.67)
  Bottom Layer w0.254: v1(35.56,26.67) 31.62,22.73 D1.1 23.68,20.07 19.69,20.07 17.4,17.78 17.4,10.67 15.24,8.51 v1(10.41,8.51)
$1N13209: length 46.4
  Top Layer w0.254: R2.2 27.81,30.98 v1(27.81,18.16) ; USB1.10 v1(46.33,4.83)
  Bottom Layer w0.254: v1(46.33,4.83) 44.3,2.79 38.48,2.79 36.58,4.7 36.58,13.97 34.93,15.62 30.35,15.62 v1(27.81,18.16)
$1N13212: length 55.5
  Top Layer w0.254: v1(26.8,6.86) 26.8,11.56 29.08,13.84 29.08,33.39 R1.2 ; USB1.4 43.33,5.48 41.66,3.81 36.32,3.81 33.02,0.51 27.81,0.51 v1(26.8,1.52)
  Bottom Layer w0.254: v1(26.8,6.86) v1(26.8,1.52)
$1N13419: length 42.8
  Top Layer w0.254: v1(48.9,63.25) 39.37,63.25 36.7,60.58 U5.5 ; H3.3 H6.3
  Bottom Layer w0.254: H6.3 52.32,55.12 56.9,55.12 58.29,56.51 58.29,61.98 57.02,63.25 v1(48.9,63.25)
$1N13432: length 44.4
  Top Layer w0.254: U5.6 35.43,60.94 38.63,64.13 v1(48.9,64.13) ; H3.2 H6.2
  Bottom Layer w0.254: H3.2 59.56,54.67 59.56,61.72 57.15,64.13 v1(48.9,64.13)
$1N13451: length 28.3
  Top Layer w0.254: v1(40.26,53.85) 37.08,53.85 34.16,56.77 U5.7 ; H3.1 H6.1
  Bottom Layer w0.254: v1(40.26,53.85) 46.48,53.85 H6.1
$1N13458: length 24.7
  Top Layer w0.254: U5.4 37.97,60.94 39.39,62.36 v1(48.9,62.36) ; H3.4 H6.4
  Bottom Layer w0.254: H6.4 51.31,59.94 v1(48.9,62.36)
$1N13467: length 36
  Top Layer w0.254: H4.4 51.31,42.16 H7.4 ; U5.9 v1(31.57,51.43)
  Bottom Layer w0.254: v1(31.57,51.43) 31.57,52.72 32.45,53.59 38.48,53.59 39.5,52.58 45.72,52.58 49.4,48.89 49.4,44.07 H7.4
$1N13474: length 32.6
  Top Layer w0.254: v1(45.47,38.23) v1(47.12,39.88) ; H4.3 51.31,39.62 H7.3 ; U5.10 v1(34.16,47.88)
  Bottom Layer w0.254: v1(34.16,47.88) 34.16,42.29 38.23,38.23 v1(45.47,38.23) ; v1(47.12,39.88) H7.3
$1N13481: length 60.7
  Top Layer w0.254: v1(45.47,49.15) 47.24,49.15 48.39,48.01 48.39,38.73 49.78,37.34 H7.2 56.26,37.34 H4.2 ; 35.43,47.12 34.67,46.35 32.77,46.35 31.62,45.21 31.62,36.45 32.89,35.18 v1(42.67,35.18) ; 35.43,47.12 36.32,46.23 v1(42.55,46.23) ; 35.43,47.12 U5.11
  Bottom Layer w0.254: 42.67,46.35 45.34,49.02
$1N13488: length 32.1
  Top Layer w0.254: H4.1 51.31,34.54 H7.1 46.36,34.8 44.58,36.58 44.58,45.21 42.8,46.99 38.5,46.99 36.7,48.79 U5.12

## Copper pours and planes (outline as drawn; the poured copper is in the pictures)
GND on Top Layer: -3.05,95.88 68.07,95.88 68.07,-5.08 -3.05,-5.08
GND on Bottom Layer: -2.66,95.88 68.07,95.88 68.07,-5.08 -2.66,-5.08

Small or netless copper shapes (teardrops, artwork), in the pictures only: 129 on Top Layer, 48 on Bottom Layer

## Text on the board
Top Silkscreen Layer: P0 | P2 | P3 | P4 | P1 | P5 | P7 | P6 | KEY0 | KEY1 | KEY2 | CH340 | ESP32 typec口朝向 | OLED | DC12V 输入
